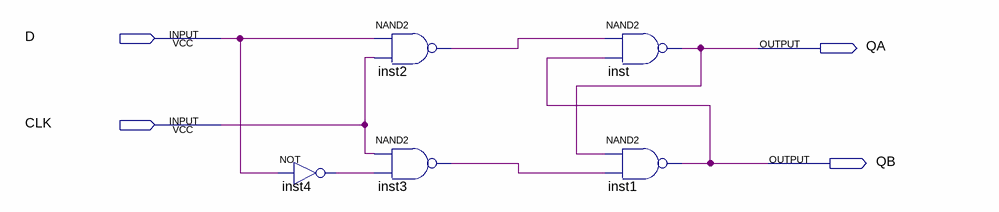
[diagram p0: schematic sheet]
// Quartus schematic Block1.bdf as structural Verilog: 5 symbols, 4 pins
module Block1 (
  input  D,
  input  CLK,
  output QA,
  output QB
);

  wire inst2_out, inst3_out, inst4_out;

  not inst4 (inst4_out, D);
  nand inst2 (inst2_out, D, CLK);
  nand inst3 (inst3_out, CLK, inst4_out);
  nand inst (QA, inst2_out, QB);
  nand inst1 (QB, QA, inst3_out);
endmodule
